# Altium schematic sheet Power.SchDoc
size A4
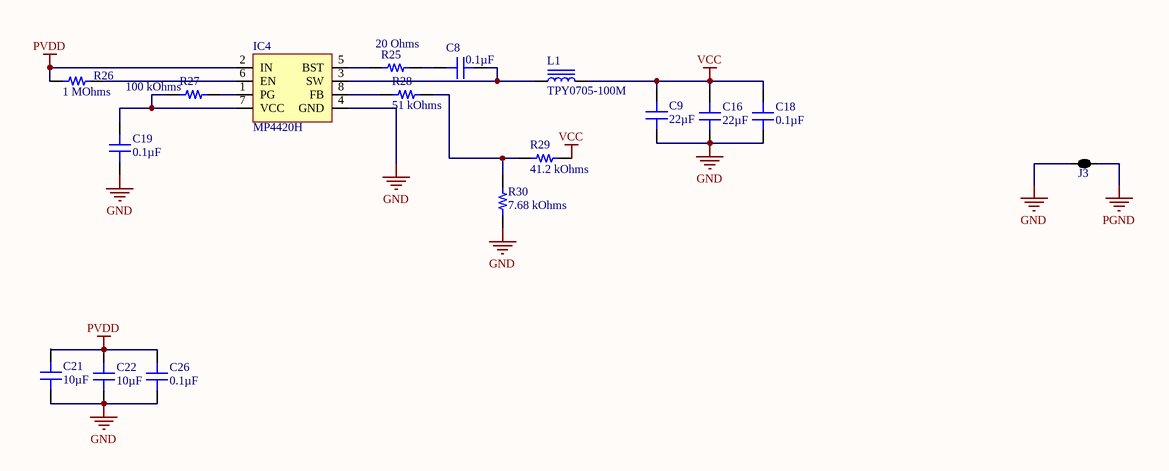
[diagram p0: Power.SchDoc]

## Parts
C8  0.1µF  [CAP 0603_1608]
C9  22µF  [CAP 1210_3225 - 1MM]
C16  22µF  [CAP 1210_3225 - 1MM]
C18  0.1µF  [CAP 0603_1608]
C19  0.1µF  [CAP 0603_1608]
C21  10µF  [CAP 1210_3225 - 1.8MM]
C22  10µF  [CAP 1210_3225 - 1.8MM]
C26  0.1µF  [CAP 0603_1608]
IC4  MP4420H  [TSOT23-8]
J3  2 way net tie junction  [2way_HP]  (value not drawn)  (net tie, no BOM)
L1  TPY0705-100M  [INDP6868X46N]
R25  20 Ohms  [RES 0603_1608]
R26  1 MOhms  [RES 0603_1608]
R27  100 kOhms  [RES 0603_1608]
R28  51 kOhms  [RES 0805_2012]
R29  41.2 kOhms  [RES 0805_2012]
R30  7.68 kOhms  [RES 0805_2012]

## Nets
GND: C9.1 C16.1 C18.1 C19.1 C21.1 C22.1 C26.1 IC4.4(GND) J3.1 R30.1
PGND: J3.2
PVDD: C21.2 C22.2 C26.2 IC4.2(IN) R26.1
VCC: C9.2 C16.2 C18.2 L1.2 R29.2
NetC8_1: C8.1 R25.2
NetC8_2: C8.2 IC4.3(SW) L1.1
NetC19_2: C19.2 IC4.7(VCC) R27.1
NetIC4_1: IC4.1(PG) R27.2
NetIC4_5: IC4.5(BST) R25.1
NetIC4_6: IC4.6(EN) R26.2
NetIC4_8: IC4.8(FB) R28.1
NetR28_2: R28.2 R29.1 R30.2

## Library data of the parts
C8 C18 C19 C26 = CML0603X7R104KT50V: CAP CER 0.1UF 50V X7R 0603; Manufacturer: Stackpole Electronics Inc; Tolerance: ±10%; Part Number: CML0603X7R104KT50V; Value: 0.1µF; Applications: General Purpose; Capacitance: 0.1µF; ComponentLink1Description: Datasheet; ComponentLink1URL: http://www.seielect.com/Catalog/SEI-CML.PDF; ComponentLink2Description: DigiKey Link; ComponentLink2URL: http://digikey.com/product-detail/en/stackpole-electronics-inc/CML0603X7R104KT50V/738-CML0603X7R104KT50VCT-ND/10660220; Device Package: 0603 (1608 Metric); LastUpdated: 2.9.2020 01:03:28; Lifecycle Status: Active; Minimum Order: 1; Mounting Type: Surface Mount, MLCC; Operating Temperature: -55°C ~ 125°C; Package / Case: 0603 (1608 Metric); Packaging: Unknown; PartId: 26324; Part Status: Active; Price: 0.01; Series: CML_X7R; Supplier 1: DigiKey; Supplier Part Number 1: 738-CML0603X7R104KT50VCT-ND; Temperature Coefficient: X7R; Voltage - Rated: 50V
C9 C16 = EMK325BJ226MD-T: CAP CER 22UF 16V X5R 1210; Manufacturer: Taiyo Yuden; Tolerance: ±20%; Part Number: EMK325BJ226MD-T; Value: 22µF; Applications: General Purpose; Capacitance: 22µF; ComponentLink1Description: Datasheet; ComponentLink1URL: https://ds.yuden.co.jp/TYCOMPAS/ut/detail?pn=EMK325BJ226MD-T  &u=M; ComponentLink2Description: DigiKey Link; ComponentLink2URL: http://digikey.com/product-detail/en/taiyo-yuden/EMK325BJ226MD-T/587-2412-1-ND/2230278; Device Package: 1210 (3225 Metric); LastUpdated: 2.9.2020 01:10:27; Lifecycle Status: Active; Minimum Order: 1; Mounting Type: Surface Mount, MLCC; Operating Temperature: -55°C ~ 85°C; Package / Case: 1210 (3225 Metric); Packaging: TapeAndReel; PartId: 25269; Part Status: Active; Price: 0.25; Series: M; Size / Dimension: 0.126" L x 0.098" W (3.20mm x 2.50mm); Supplier 1: DigiKey; Supplier Part Number 1: 587-2412-1-ND; Temperature Coefficient: X5R; Thickness (Max): 0.037" (0.95mm); Voltage - Rated: 16V
C21 C22 = 1210BW106K500NGX110T: CAP CER 10UF 50V X5R 1210; Manufacturer: Knowles Novacap; Tolerance: ±10%; Part Number: 1210BW106K500NGX110T; Value: 10µF; Applications: General Purpose; Capacitance: 10µF; ComponentLink1Description: Datasheet; ComponentLink1URL: https://www.knowlescapacitors.com/getattachment/6c8d48ef-fc2b-4752-ae2c-ce6c208de0c4/High-Capacitance-Chip.aspx; ComponentLink2Description: DigiKey Link; ComponentLink2URL: http://digikey.com/product-detail/en/knowles-novacap/1210BW106K500NGX110T/1763-1137-1-ND/7304036; Device Package: 1210 (3225 Metric); Features: Gold Flash Termination; LastUpdated: 2.9.2020 01:10:35; Lifecycle Status: Active; Minimum Order: 1; Mounting Type: Surface Mount, MLCC; Operating Temperature: -55°C ~ 85°C; Package / Case: 1210 (3225 Metric); Packaging: TapeAndReel; PartId: 24853; Part Status: Active; Price: 5.15; Series: -; Size / Dimension: 0.125" L x 0.100" W (3.18mm x 2.54mm); Supplier 1: DigiKey; Supplier Part Number 1: 1763-1137-1-ND; Temperature Coefficient: X5R; Thickness (Max): 0.065" (1.65mm); Voltage - Rated: 50V
IC4 = MP4420H: V.REG.2A 3.8V-36V STEP-DOW TSOT-23-8
J3 = 2way: ComponentLink1URL: http://www.edatools.cz/addons; ComponentLink1Description: Source; FootprintNote: LP=12mil, MP=40mil, HP=120mil
L1 = TPY0705-100M: INDUCTOR FIXED 10UH 7X7MM SMD
R25 = CRCW060320R0FKEB: RES SMD 20 OHM 1% 1/10W 0603; Manufacturer: Vishay Dale; Power (Watts): 0.1W, 1/10W; Temperature Coefficient: ±100ppm/°C; Part Number: CRCW060320R0FKEB; Value: 20 Ohms; ComponentLink1Description: Datasheet; ComponentLink1URL: http://www.vishay.com/docs/20035/dcrcwe3.pdf; ComponentLink2Description: DigiKey Link; ComponentLink2URL: http://digikey.com/product-detail/en/vishay-dale/CRCW060320R0FKEB/541-CRCW060320R0FKEBCT-ND/11500739; Composition: Thick Film; Device Package: 0603 (1608 Metric); Features: Automotive AEC-Q200; LastUpdated: 2.9.2020 01:09:23; Lifecycle Status: Active; Minimum Order: 1; Number of Terminations: 2; Operating Temperature: -55°C ~ 155°C; Package / Case: 0603 (1608 Metric); Packaging: Unknown; PartId: 56605; Price: 0.10; Ratings: AEC-Q200; Resistance: 20 Ohms; Series: CRCW; Supplier 1: DigiKey; Supplier Part Number 1: 541-CRCW060320R0FKEBCT-ND; Supplier Device Package: 0603; Tolerance: ±1%
R26 = KTR03EZPJ105: RES SMD 1M OHM 5% 1/10W 0603; Manufacturer: Rohm Semiconductor; Power (Watts): 0.1W, 1/10W; Temperature Coefficient: ±200ppm/°C; Part Number: KTR03EZPJ105; Value: 1 MOhms; ComponentLink1Description: Datasheet; ComponentLink1URL: https://www.rohm.com/datasheet/KTR03EZPF/ktr-e; ComponentLink2Description: DigiKey Link; ComponentLink2URL: http://digikey.com/product-detail/en/rohm-semiconductor/KTR03EZPJ105/RHM1.0MAZCT-ND/2290033; Composition: Thick Film; Device Package: 0603 (1608 Metric); Features: Automotive AEC-Q200, High Voltage; Height - Seated (Max): 0.022" (0.55mm); LastUpdated: 2.9.2020 01:09:32; Lifecycle Status: Active; Minimum Order: 1; Number of Terminations: 2; Operating Temperature: -55°C ~ 155°C; Package / Case: 0603 (1608 Metric); Packaging: TapeAndReel; PartId: 25545; Part Status: Active; Price: 0.01; Ratings: AEC-Q200; Resistance: 1 MOhms; Series: KTR; Size / Dimension: 0.063" L x 0.031" W (1.60mm x 0.80mm); Supplier 1: DigiKey; Supplier Part Number 1: RHM1.0MAZCT-ND; Supplier Device Package: 0603; Tolerance: ±5%
R27 = CR0603-JW-104ELF: RES SMD 100K OHM 5% 1/10W 0603; Manufacturer: Bourns Inc.; Power (Watts): 0.1W, 1/10W; Temperature Coefficient: ±200ppm/°C; Part Number: CR0603-JW-104ELF; Value: 100 kOhms; ComponentLink1Description: Datasheet; ComponentLink1URL: https://www.bourns.com/docs/Product-Datasheets/CHPREZTR.pdf; ComponentLink2Description: DigiKey Link; ComponentLink2URL: http://digikey.com/product-detail/en/bourns-inc/CR0603-JW-104ELF/CR0603-JW-104ELFCT-ND/3767631; Composition: Thick Film; Device Package: 0603 (1608 Metric); Features: Moisture Resistant; Height - Seated (Max): 0.022" (0.55mm); LastUpdated: 2.9.2020 01:09:31; Lifecycle Status: Active; Minimum Order: 1; Number of Terminations: 2; Operating Temperature: -55°C ~ 155°C; Package / Case: 0603 (1608 Metric); Packaging: CutTape; PartId: 25661; Part Status: Active; Price: 0.10; Resistance: 100 kOhms; Series: CR0603; Size / Dimension: 0.063" L x 0.031" W (1.60mm x 0.80mm); Supplier 1: DigiKey; Supplier Part Number 1: CR0603-JW-104ELFCT-ND; Supplier Device Package: 0603; Tolerance: ±5%
R28 = RN73R2ATTD5102B25: RES 51K OHM 0.1% 1/8W 0805; Manufacturer: KOA Speer Electronics, Inc.; Power (Watts): 0.125W, 1/8W; Temperature Coefficient: ±25ppm/°C; Part Number: RN73R2ATTD5102B25; Value: 51 kOhms; ComponentLink1Description: Datasheet; ComponentLink1URL: //media.digikey.com/pdf/Data%20Sheets/KOA%20Speer/RN73R_Type_DS.pdf; ComponentLink2Description: DigiKey Link; ComponentLink2URL: http://digikey.com/product-detail/en/koa-speer-electronics-inc/RN73R2ATTD5102B25/2019-RN73R2ATTD5102B25CT-ND/9992012; Composition: Metal Film; Device Package: 0805 (2012 Metric); Features: Moisture Resistant; Height - Seated (Max): 0.024" (0.60mm); LastUpdated: 2.9.2020 01:14:33; Lifecycle Status: Active; Minimum Order: 1; Number of Terminations: 2; Operating Temperature: -55°C ~ 155°C; Package / Case: 0805 (2012 Metric); Packaging: TapeAndReel; PartId: 48095; Part Status: Active; Price: 0.07; Resistance: 51 kOhms; Series: RN73R; Size / Dimension: 0.079" L x 0.049" W (2.00mm x 1.25mm); Supplier 1: DigiKey; Supplier Part Number 1: 2019-RN73R2ATTD5102B25CT-ND; Supplier Device Package: 0805; Tolerance: ±0.1%
R29 = ERJ-6ENF4122V: RES SMD 41.2K OHM 1% 1/8W 0805; Manufacturer: Panasonic Electronic Components; Power (Watts): 0.125W, 1/8W; Temperature Coefficient: ±100ppm/°C; Part Number: ERJ-6ENF4122V; Value: 41.2 kOhms; ComponentLink1Description: Datasheet; ComponentLink1URL: https://industrial.panasonic.com/cdbs/www-data/pdf/RDA0000/AOA0000C304.pdf; ComponentLink2Description: DigiKey Link; ComponentLink2URL: http://digikey.com/product-detail/en/panasonic-electronic-components/ERJ-6ENF4122V/P41.2KCCT-ND/119439; Composition: Thick Film; Device Package: 0805 (2012 Metric); Features: Automotive AEC-Q200; Height - Seated (Max): 0.028" (0.70mm); LastUpdated: 2.9.2020 01:14:35; Lifecycle Status: Active; Minimum Order: 1; Number of Terminations: 2; Operating Temperature: -55°C ~ 155°C; Package / Case: 0805 (2012 Metric); Packaging: TapeAndReel; PartId: 47885; Part Status: Active; Price: 0.01; Ratings: AEC-Q200; Resistance: 41.2 kOhms; Series: ERJ; Size / Dimension: 0.079" L x 0.049" W (2.00mm x 1.25mm); Supplier 1: DigiKey; Supplier Part Number 1: P41.2KCCT-ND; Supplier Device Package: 0805; Tolerance: ±1%
R30 = ERA-6AEB7681V: RES 7.68K OHM 0.1% 1/8W 0805; Manufacturer: Panasonic Electronic Components; Power (Watts): 0.125W, 1/8W; Temperature Coefficient: ±25ppm/°C; Part Number: ERA-6AEB7681V; Value: 7.68 kOhms; ComponentLink1Description: Datasheet; ComponentLink1URL: https://industrial.panasonic.com/cdbs/www-data/pdf/RDM0000/AOA0000C307.pdf; ComponentLink2Description: DigiKey Link; ComponentLink2URL: http://digikey.com/product-detail/en/panasonic-electronic-components/ERA-6AEB7681V/P7.68KDACT-ND/3075246; Composition: Thin Film; Device Package: 0805 (2012 Metric); Features: Automotive AEC-Q200; Height - Seated (Max): 0.024" (0.60mm); LastUpdated: 2.9.2020 01:14:29; Lifecycle Status: Active; Minimum Order: 1; Number of Terminations: 2; Operating Temperature: -55°C ~ 155°C; Package / Case: 0805 (2012 Metric); Packaging: TapeAndReel; PartId: 48833; Part Status: Active; Price: 0.04; Ratings: AEC-Q200; Resistance: 7.68 kOhms; Series: ERA-6A; Size / Dimension: 0.079" L x 0.049" W (2.00mm x 1.25mm); Supplier 1: DigiKey; Supplier Part Number 1: P7.68KDACT-ND; Supplier Device Package: 0805; Tolerance: ±0.1%